# Altium project Luchador Rev 3.2.PrjPcb (part 2 of 4)

## Sheet Power Supply.SchDoc
size B; SheetNumber: 3; SheetTotal: 11; TitleBlk1Sch: PCBA, LUCHADOR, REV 3.2b, AMBER; Eng: Haman; EngDate: 3-15-19; RevSch: 01; TitleBlk2Sch: Power Supply
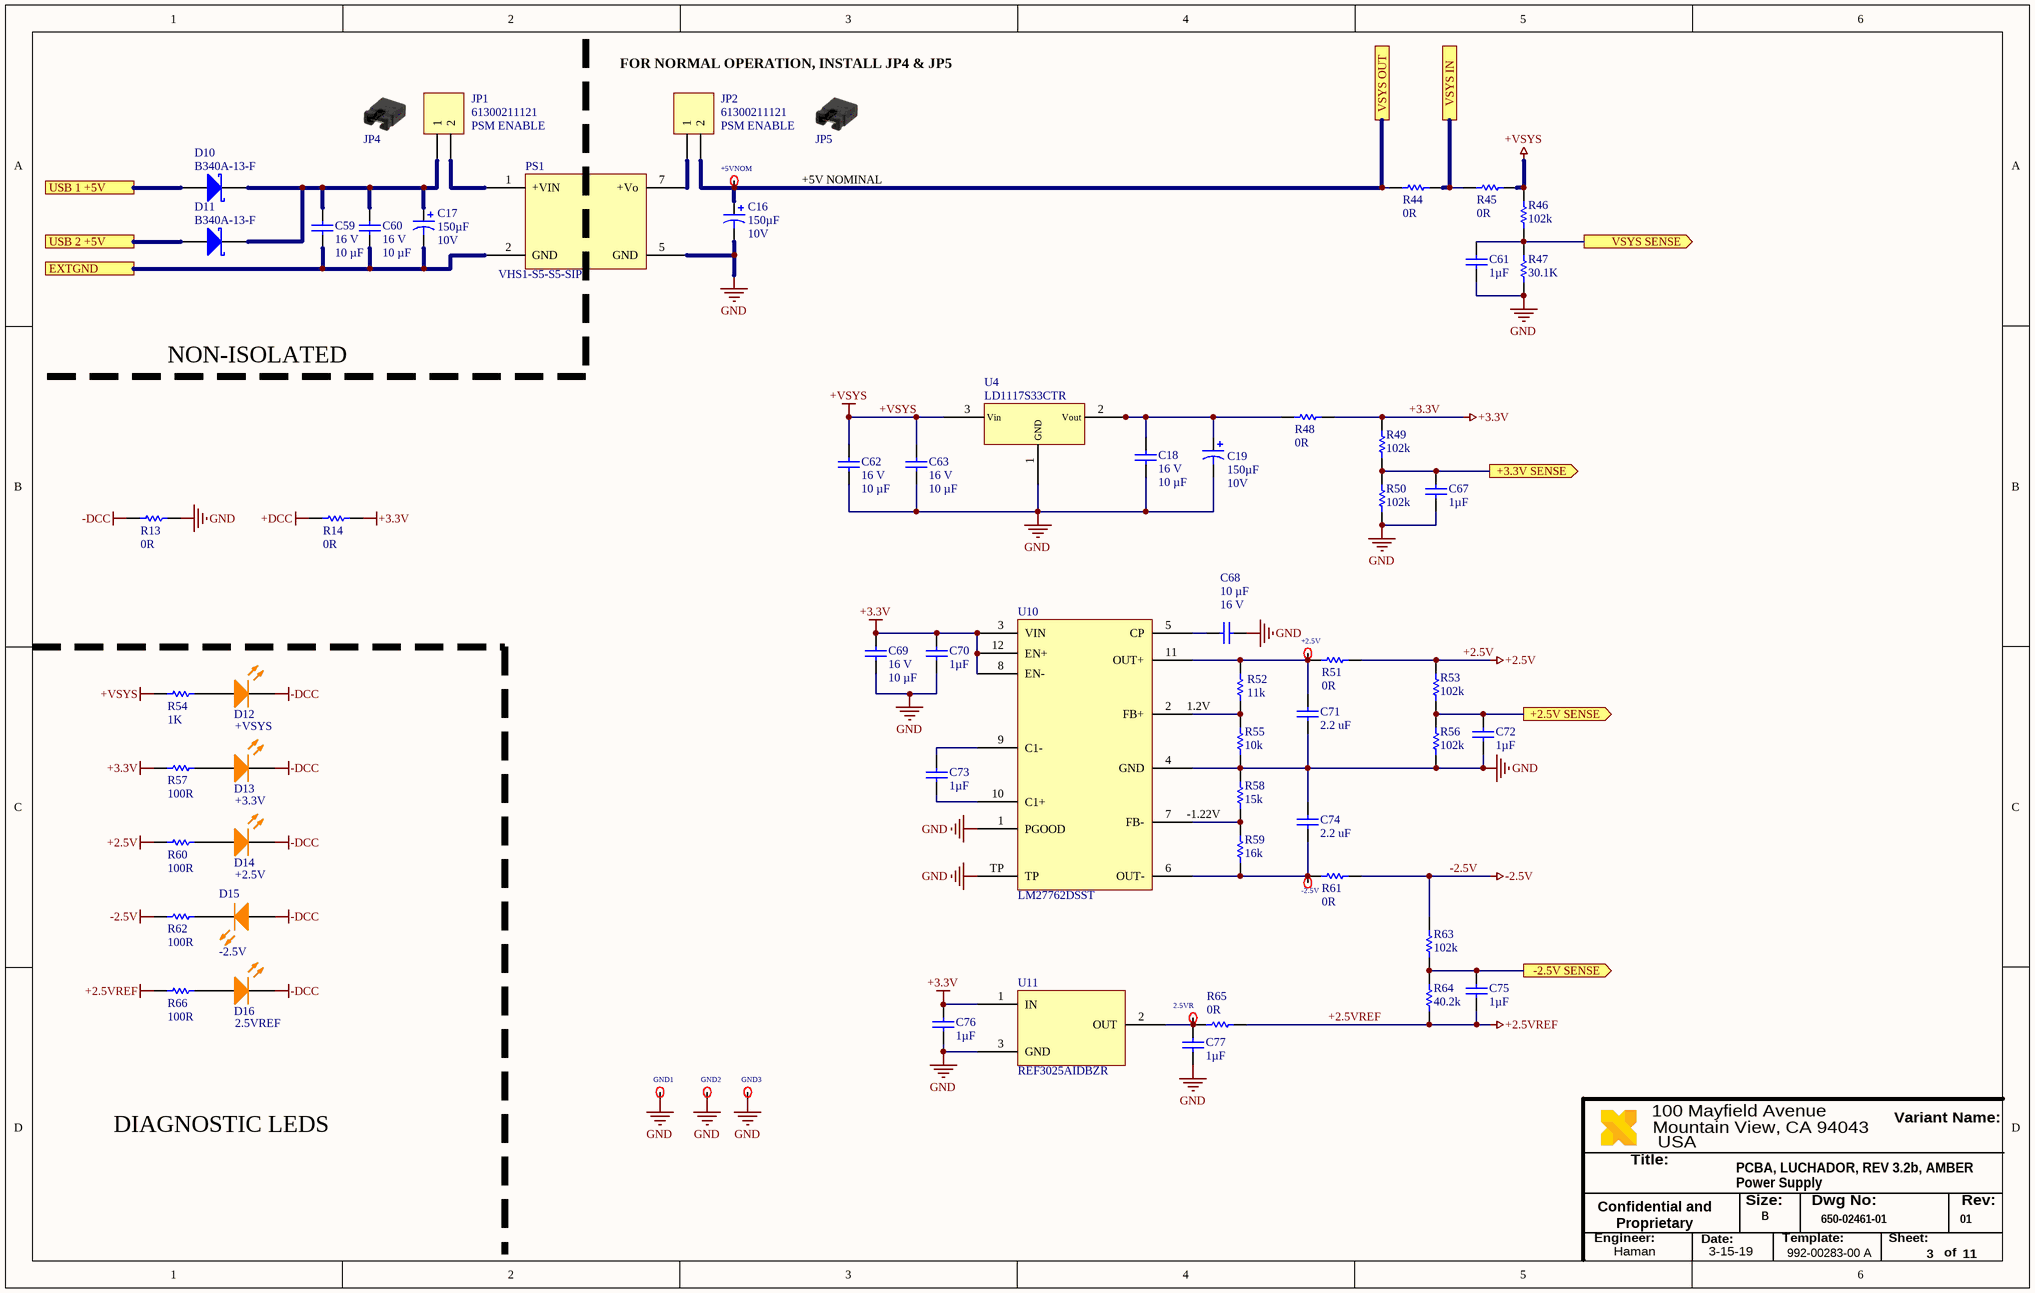
[diagram p2: Power Supply.SchDoc]

### Parts
2.5VR  5001  [KEYSTONE TP]  (value not drawn)  (no BOM)
+2.5V  5001  [KEYSTONE TP]  (value not drawn)  (no BOM)
+5VNOM  5001  [KEYSTONE TP]  (value not drawn)  (no BOM)
-2.5V  5001  [KEYSTONE TP]  (value not drawn)  (no BOM)
C16  Capacitance: 150µF  Voltage - Rated: 10V  [2917]  (hidden comment: Cap Pol1)
C17  Capacitance: 150µF  Voltage - Rated: 10V  [2917]  (hidden comment: Cap Pol1)
C18  Nominal voltage: 16 V  Capacity (elec.): 10 µF  [1206C]  (hidden comment: 50V)
C19  Capacitance: 150µF  Voltage - Rated: 10V  [2917]  (hidden comment: Cap Pol1)
C59  Nominal voltage: 16 V  Capacity (elec.): 10 µF  [1206C]  (hidden comment: 50V)
C60  Nominal voltage: 16 V  Capacity (elec.): 10 µF  [1206C]  (hidden comment: 50V)
C61  Capacitance: 1µF  [0402C]  (hidden comment: 50V)
C62  Nominal voltage: 16 V  Capacity (elec.): 10 µF  [1206C]  (hidden comment: 50V)
C63  Nominal voltage: 16 V  Capacity (elec.): 10 µF  [1206C]  (hidden comment: 50V)
C67  Capacitance: 1µF  [0402C]  (hidden comment: 50V)
C68  Nominal voltage: 16 V  Capacity (elec.): 10 µF  [1206C]  (hidden comment: 50V)
C69  Nominal voltage: 16 V  Capacity (elec.): 10 µF  [1206C]  (hidden comment: 50V)
C70  Capacitance: 1µF  [0402C]  (hidden comment: 50V)
C71  Capacitance Value: 2.2 uF  [0402C]  (hidden comment: 50V)
C72  Capacitance: 1µF  [0402C]  (hidden comment: 50V)
C73  Capacitance: 1µF  [0402C]  (hidden comment: 50V)
C74  Capacitance Value: 2.2 uF  [0402C]  (hidden comment: 50V)
C75  Capacitance: 1µF  [0402C]  (hidden comment: 50V)
C76  Capacitance: 1µF  [0402C]  (hidden comment: 50V)
C77  Capacitance: 1µF  [0402C]  (hidden comment: 50V)
D10  Manufacturer Part Number: B340A-13-F  [SMA]  (hidden comment: BAT46ZFILM)
D11  Manufacturer Part Number: B340A-13-F  [SMA]  (hidden comment: BAT46ZFILM)
D12  +VSYS  [0402L-ORANGE]
D13  +3.3V  [0402L-ORANGE]
D14  +2.5V  [0402L-ORANGE]
D15  -2.5V  [0402L-ORANGE]
D16  2.5VREF  [0402L-ORANGE]
GND1  5001  [KEYSTONE TP]  (value not drawn)  (no BOM)
GND2  5001  [KEYSTONE TP]  (value not drawn)  (no BOM)
GND3  5001  [KEYSTONE TP]  (value not drawn)  (no BOM)
JP1  PSM ENABLE  [61300211121]
JP2  PSM ENABLE  [61300211121]
JP4  QPC02SXGN-RC  (value not drawn)  (mechanical)
JP5  QPC02SXGN-RC  (value not drawn)  (mechanical)
PS1  VHS1-S5-S5-SIP  [ISOLATED MODULE]
R13  Resistance (Ohms): 0R  [0402R]  (hidden comment: Res 0805)
R14  Resistance (Ohms): 0R  [0402R]  (hidden comment: Res 0805)
R44  Resistance (Ohms): 0R  [0402R]  (hidden comment: Res 0805)
R45  Resistance (Ohms): 0R  [0402R]  (hidden comment: Res 0805)
R46  Resistance: 102k  [0402R]  (hidden comment: Res 0805)
R47  Resistance: 30.1K  [0402R]  (hidden comment: Res 0805)
R48  Resistance (Ohms): 0R  [0402R]  (hidden comment: Res 0805)
R49  Resistance: 102k  [0402R]  (hidden comment: Res 0805)
R50  Resistance: 102k  [0402R]  (hidden comment: Res 0805)
R51  Resistance (Ohms): 0R  [0402R]  (hidden comment: Res 0805)
R52  Resistance: 11k  [0402R]  (hidden comment: Res 0805)
R53  Resistance: 102k  [0402R]  (hidden comment: Res 0805)
R54  Resistance: 1K  [0402R]  (hidden comment: Res 0805)
R55  Resistance: 10k  [0402R]  (hidden comment: Res 0805)
R56  Resistance: 102k  [0402R]  (hidden comment: Res 0805)
R57  Resistance: 100R  [0402R]  (hidden comment: Res 0805)
R58  Resistance: 15k  [0402R]  (hidden comment: Res 0805)
R59  Resistance: 16k  [0402R]  (hidden comment: Res 0805)
R60  Resistance: 100R  [0402R]  (hidden comment: Res 0805)
R61  Resistance (Ohms): 0R  [0402R]  (hidden comment: Res 0805)
R62  Resistance: 100R  [0402R]  (hidden comment: Res 0805)
R63  Resistance: 102k  [0402R]  (hidden comment: Res 0805)
R64  Resistance: 40.2k  [0402R]  (hidden comment: Res 0805)
R65  Resistance (Ohms): 0R  [0402R]  (hidden comment: Res 0805)
R66  Resistance: 100R  [0402R]  (hidden comment: Res 0805)
U4  LD1117S33CTR  [SOT-223]
U10  LM27762DSST  [WFDFN-12]
U11  REF3025AIDBZR  [SOT-23]

### Ports
+2.5V SENSE (out), +3.3V SENSE (out), -2.5V SENSE (out), EXTGND, USB 1 +5V, USB 2 +5V, VSYS IN, VSYS OUT, VSYS SENSE (out)

### Nets
+2.5V: R51.2 R53.2 R60.1
+2.5VREF: C75.2 R64.1 R65.2 R66.1
+3.3V: C69.1 C70.1 C76.1 R14.2 R48.2 R49.2 R57.1 U10.3(VIN) U10.8(EN-) U10.12(EN+) U11.1(IN)
+DCC: R14.1
+VSYS: C62.1 C63.1 R45.2 R46.2 R54.1 U4.3(Vin)
-2.5V: R61.2 R62.1 R63.2
-DCC: D12.2(K) D13.2(K) D14.2(K) D15.1(A) D16.2(K) R13.1
GND: C16.2 C18.2 C19.2 C61.2 C62.2 C63.2 C67.2 C68.2 C69.2 C70.2 C71.2 C72.2 C74.1 C76.2 C77.2 GND1.1 GND2.1 GND3.1 PS1.5(GND) R13.2 R47.1 R50.1 R55.1 R56.1 R58.2 U4.1(GND) U10.1(PGOOD) U10.4(GND) U10.TP U11.3(GND)
Net2.5VR_1: 2.5VR.1 C77.1 R65.1 U11.2(OUT)
Net+2.5V_1: +2.5V.1 C71.1 R51.1 R52.2 U10.11(OUT+)
Net+5VNOM_1: +5VNOM.1 C16.1 JP2.2 R44.1 ; port VSYS OUT
Net-2.5V_1: -2.5V.1 C74.2 R59.1 R61.1 U10.6(OUT-)
NetC17_1: C17.1 C59.1 C60.1 D10.2(K) D11.2(K) JP1.1
NetC17_2: C17.2 C59.2 C60.2 PS1.2(GND) ; port EXTGND
NetC18_1: C18.1 C19.1 R48.1 U4.2(Vout) U4.4(Vout)
NetC61_1: C61.1 R46.1 R47.2 ; port VSYS SENSE
NetC67_1: C67.1 R49.1 R50.2 ; port +3.3V SENSE
NetC68_1: C68.1 U10.5(CP)
NetC72_1: C72.1 R53.1 R56.2 ; port +2.5V SENSE
NetC73_1: C73.1 U10.9(C1-)
NetC73_2: C73.2 U10.10(C1+)
NetC75_1: C75.1 R63.1 R64.2 ; port -2.5V SENSE
NetD10_1: D10.1(A) ; port USB 1 +5V
NetD11_1: D11.1(A) ; port USB 2 +5V
NetD12_1: D12.1(A) R54.2
NetD13_1: D13.1(A) R57.2
NetD14_1: D14.1(A) R60.2
NetD15_2: D15.2(K) R62.2
NetD16_1: D16.1(A) R66.2
NetJP1_2: JP1.2 PS1.1(+VIN)
NetJP2_1: JP2.1 PS1.7(+Vo)
NetR44_2: R44.2 R45.1 ; port VSYS IN
NetR52_1: R52.1 R55.2 U10.2(FB+)
NetR58_1: R58.1 R59.2 U10.7(FB-)

### Notes on the sheet
- (near JP5) FOR NORMAL OPERATION, INSTALL JP4 & JP5
- +5V NOMINAL
- NON-ISOLATED
- 1.2V
- -1.22V
- DIAGNOSTIC LEDS
- Title:
- USA
- 100 Mayfield Avenue
- Mountain View, CA 94043
- Variant Name:
- Confidential and Proprietary
- Engineer:
- Date:
- Size:
- B
- Template:
- 992-00283-00 A
- Dwg No:
- Sheet:
- Rev:
- of

### Library data of the parts
2.5VR +2.5V +5VNOM -2.5V GND1-GND3 = 5001: Manufacturer: Keystone Electronics; Description1: TEST POINT PC MINI .040"D BLACK; Supplier 1: Digi-Key; Manufacturer Part Number: 5001; RoHS: RoHS Compliant; Category: Test and Measurement; Stock 1: 159085; Pricing 1: 1=0.34, 10=0.315, 50=0.2296, 100=0.2206, 250=0.19812, 500=0.1891, 1000=0.15759, 2500=0.14408, 5000=0.13508 (USD); Packaging: Bulk; Type: PC Test Point, Miniature; Terminal: 0.010" x 0.020" (0.25mm x 0.51mm) Phosphor Bronze Wire, Silver Plated; Mounting Type: 0.040" (1.02mm) Hole Diameter; Material: Base, Nylon 46, UL 94V-0; Color: Black; ComponentLink1URL: http://www.keyelco.com/product-pdf.cfm?p=1310; ComponentLink1Description: http://www.keyelco.com/product-pdf.cfm?p=1310; Supplier Part Number 1: 5001K-ND
C16 C17 C19 = Cap Pol1: Polarized Capacitor (Radial); Manufacturer: KEMET; Manufacturer Part Number: T530D157M010ATE005; Manufacturer Size Code: D; Description1: Cap Tant Organic 150uF 10VDC D CASE 20% (7.3 X 4.3 X 2.8mm) SMD 7343-31 0.005 Ohm 125C T/R; Featured Product: KO-CAP Organic Polymer Capacitors  T530 Series Polymer Electrolytic Capacitors; PCN Design/Specification: TA Polymer SMD Black Epoxy Conversion 24/Oct/2014; EDA / CAD Models: Download from Accelerated Designs; Tolerance: ±20%; ESR (Equivalent Series Resistance): 5 mOhm; Type: Molded; Lifetime @ Temp.: 2000 Hrs @ 105°C; Online Catalog: KO Cap T530 Series; Other Names: 399-10369-2; Supplier 1: Digi-Key; Supplier Part Number 1: 399-10369-1-ND; Stock 1: 6616; Pricing 1: 1=5.98, 10=5.313, 100=4.2504 (USD); Standard Package: 500; Category: Capacitors; Family: Tantalum - Polymer Capacitors; Series: KO-CAP T530; Packaging: Tape & Reel (TR); Operating Temperature: -55°C ~ 125°C; Mounting Type: Surface Mount; Package / Case: 2917 (7343 Metric); Size / Dimension: 0.287" L x 0.169" W (7.30mm x 4.30mm); Height - Seated (Max): 0.122" (3.10mm); Lead Spacing: -; Features: General Purpose
C18 C59 C60 C62 C63 C68 C69 = Cap: CAP .1UF 50V CERAMIC Y5V 0805; Manufacturer: Murata; Manufacturer Part Number: GRM31CR71C106KA12L; Description1: MURATA   GRM31CR71C106KA12L   SMD Multilayer Ceramic Capacitor, 10 F,  10%, X7R, 16 V, 1206 [3216 Metric]; Tolerance: 10 %; Material properties: X7R; Content: 1 pc(s); Type: SMD; Revision: July-2002: Re-released for DXP Platform.; Supplier 1: Digi-Key; Supplier Part Number 1: 490-10526-2-ND; Stock 1: 0; Pricing 1: 2000=0.08 (USD); Category: Ceramic capacitor; Material: Ceramic; ComponentLink1URL: https://datasheet.ciiva.com/22774/608985-22774038.pdf; ComponentLink1Description: https://datasheet.ciiva.com/22774/608985-22774038.pdf; ComponentLink2URL: https://datasheet.ciiva.com/17454/c02e-17454536.pdf; ComponentLink2Description: https://datasheet.ciiva.com/17454/c02e-17454536.pdf; ComponentLink3URL: https://datasheet.ciiva.com/11607/c02e-11607499.pdf; ComponentLink3Description: https://datasheet.ciiva.com/11607/c02e-11607499.pdf; ComponentLink4URL: https://datasheet.ciiva.com/18697/c02e-18697819.pdf; ComponentLink4Description: https://datasheet.ciiva.com/18697/c02e-18697819.pdf; ComponentLink5URL: https://datasheet.ciiva.com/7937/608985-7937740.pdf; ComponentLink5Description: https://datasheet.ciiva.com/7937/608985-7937740.pdf; ComponentLink6URL: https://datasheet.ciiva.com/18697/c02e-18697820.pdf; ComponentLink6Description: https://datasheet.ciiva.com/18697/c02e-18697820.pdf; ComponentLink7URL: https://datasheet.ciiva.com/18697/c02e-18697821.pdf; ComponentLink7Description: https://datasheet.ciiva.com/18697/c02e-18697821.pdf; ComponentLink8URL: https://datasheet.ciiva.com/29202/451342-da-01-de-vs-kondens-grm31-cr71c-106ka12l-29202404.pdf; ComponentLink8Description: https://datasheet.ciiva.com/29202/451342-da-01-de-vs-kondens-grm31-cr71c-106ka12l-29202404.pdf; ComponentLink9URL: https://datasheet.ciiva.com/29202/450988-da-01-de-vs-chip-kond-1206-10-0-uf-10pr-16-0v-x7r-29202582.pdf; ComponentLink9Description: https://datasheet.ciiva.com/29202/450988-da-01-de-vs-chip-kond-1206-10-0-uf-10pr-16-0v-x7r-29202582.pdf
C61 C67 C70 C72 C73 C75-C77 = Cap: CAP .1UF 50V CERAMIC Y5V 0805; Manufacturer: TDK; Manufacturer Part Number: CGB2A1JB1C105K033BC; PCN Part Number: MLCC Part Number Change 30/Nov/2012; Description1: 1µF ±10% 16V JB Ceramic Capacitor -25°C ~ 85°C Surface Mount, MLCC 0402 (1005 Metric) 0.039" L x 0.020" W (1.00mm x 0.50mm); Product Training Modules: SEAT, CCV, and TVCL Design Tools Guide to Replacing an Electrolytic Capacitor with an MLCC; Featured Product: CGB Series Capacitors CH and JB Temperature Coefficient Capacitors; EDA / CAD Models: Download from Accelerated Designs; Tolerance: ±10%; Voltage - Rated: 16V; Temperature Coefficient: JB; Online Catalog: CGB Series; Other Names: 445-12011-6; Revision: July-2002: Re-released for DXP Platform.; Supplier 1: Digi-Key; Supplier Part Number 1: 445-12011-1-ND; Stock 1: 7430; Pricing 1: 1=0.22, 10=0.151, 100=0.0765, 500=0.0523, 1000=0.0463, 2500=0.0443, 5000=0.0403 (USD); RoHS Information: RoHS Certificate-MLCC; Standard Package: 1; Category: Capacitors; Family: Ceramic Capacitors; Series: CGB; Packaging: Digi-Reel®; Mounting Type: Surface Mount, MLCC; Operating Temperature: -25°C ~ 85°C; Applications: General Purpose; Package / Case: 0402 (1005 Metric); Size / Dimension: 0.039" L x 0.020" W (1.00mm x 0.50mm); Thickness (Max): 0.013" (0.33mm); Features: Low Profile; ComponentLink1URL: https://product.tdk.com/info/en/catalog/datasheets/mlcc_commercial_lowprofile_en.pdf; ComponentLink1Description: https://product.tdk.com/info/en/catalog/datasheets/mlcc_commercial_lowprofile_en.pdf; ComponentLink2URL: https://product.tdk.com/info/en/catalog/spec/mlccspec_commercial_lowprofile_en.pdf; ComponentLink2Description: https://product.tdk.com/info/en/catalog/spec/mlccspec_commercial_lowprofile_en.pdf; ComponentLink3URL: http://product.tdk.com/en/catalog/datasheets/mlcc_commercial_lowprofile_en.pdf; ComponentLink3Description: http://product.tdk.com/en/catalog/datasheets/mlcc_commercial_lowprofile_en.pdf
C71 C74 = Cap: CAP .1UF 50V CERAMIC Y5V 0805; Manufacturer: Samsung; Manufacturer Part Number: CL05A225KO5NQNC; Description1: Cap Ceramic 2.2uF 16V X5R 10% SMD 0402 85C Cardboard T/R; Rad Hard: No; Product Depth: 0.5 mm; Voltage: 16 Vdc; Tolerance: 10 %; Dielectric: X5R; Product Length: 1 mm; Revision: July-2002: Re-released for DXP Platform.; Supplier 1: Digi-Key; Supplier Part Number 1: 1276-1461-1-ND; Stock 1: 100000; Pricing 1: 1=0.58, 10=0.41, 100=0.27, 500=0.2, 1000=0.17, 2500=0.16, 5000=0.15 (USD); Packaging: Tape & Reel; Package/Case: 0402; Mounting: Surface Mount; Operating Temperature: -55 to 85 °C; Construction: Flat; Product Height: 0.5 mm; Category: Capacitor Ceramic Multilayer; ComponentLink1URL: https://datasheet.ciiva.com/26838/getdatasheetpartid-357511-26838176.pdf; ComponentLink1Description: https://datasheet.ciiva.com/26838/getdatasheetpartid-357511-26838176.pdf; ComponentLink2URL: https://datasheet.ciiva.com/25724/cl05a225ko5nqnc-25724388.pdf; ComponentLink2Description: https://datasheet.ciiva.com/25724/cl05a225ko5nqnc-25724388.pdf
D10 D11 = BAT46ZFILM: Schottky Rectifier; Manufacturer: Diodes Incorporated; Description1: DIODE SCHOTTKY 40V 3A SMA; Voltage - DC Reverse (Vr) (Max): 40V; Current - Average Rectified (Io): 3A; Voltage - Forward (Vf) (Max) @ If: 500mV @ 3A; Speed: Fast Recovery =< 500ns, > 200mA (Io); Current - Reverse Leakage @ Vr: 500µA @ 40V; Capacitance @ Vr, F: 200pF @ 4V, 1MHz; Supplier 1: Digi-Key; Supplier Part Number 1: B340A-FDICT-ND; RoHS: RoHS Compliant; Category: Discrete Semiconductor Products; Stock 1: 304487; Pricing 1: 1=0.42, 10=0.339, 100=0.231, 500=0.1729, 1000=0.1295 (USD); Packaging: Cut Tape (CT); Part Status: Active; Diode Type: Schottky; Reverse Recovery Time (trr): -; Mounting Type: Surface Mount; Package / Case: DO-214AC, SMA; Supplier Device Package: SMA; Operating Temperature - Junction: -55°C ~ 150°C; ComponentLink1URL: http://www.diodes.com/_files/datasheets/ds30891.pdf; ComponentLink1Description: http://www.diodes.com/_files/datasheets/ds30891.pdf
D12-D16 = LED0_1: Typical INFRARED GaAs LED; Manufacturer: Vishay; Manufacturer Part Number: VLMO1500-GS08; Description1: Standard LEDs - SMD 0402 SOFT ORANGE Non-Diff; Illumination Color: Orange; Wavelength/Color Temperature: 605 nm; Luminous Intensity: 90 mcd; Viewing Angle: 130 deg; Lens Color/Style: Water Clear; If - Forward Current: 30 mA; Vf - Forward Voltage: 2 V; Power Rating: 75 mW; Brand: Vishay Semiconductors; Supplier 1: Digi-Key; Supplier Part Number 1: VLMO1500-GS08CT-ND; Stock 1: 194938; Pricing 1: 1=0.53, 10=0.38, 25=0.2916, 100=0.1901, 250=0.1394, 500=0.1183, 1000=0.0972 (USD); Product Category: Standard LEDs - SMD; RoHS: True; Package / Case: 0402 (1005 metric); Length: 1 mm; Height: 0.35 mm; Width: 0.5 mm; Minimum Operating Temperature: - 30 C; Maximum Operating Temperature: + 85 C; Series: VLMx; Packaging: Reel; Mounting Style: SMD/SMT; Factory Pack Quantity: 9000; Tradename: ChipLED; ComponentLink1URL: https://datasheet.ciiva.com/13945/vlmo1500-13945355.pdf; ComponentLink1Description: https://datasheet.ciiva.com/13945/vlmo1500-13945355.pdf; ComponentLink2URL: https://datasheet.ciiva.com/13945/vlmo1500-13945356.pdf; ComponentLink2Description: https://datasheet.ciiva.com/13945/vlmo1500-13945356.pdf; ComponentLink3URL: https://datasheet.ciiva.com/13945/vlmo1500-13945357.pdf; ComponentLink3Description: https://datasheet.ciiva.com/13945/vlmo1500-13945357.pdf
JP1 JP2 = Header 2: Header, 2-Pin; Manufacturer: Wurth Electronics; Description1: Headers & Wire Housings WR-PHD 2.54mm Header 2P THT; Number of Positions / Contacts: 2; Pitch: 2.54 mm; Mounting Angle: Straight; Current Rating: 3 A; Latching Type: Unlatched; Voltage Rating: 250 V; Supplier 1: Digi-Key; Supplier Part Number 1: 732-5315-ND; Manufacturer Part Number: 61300211121; Stock 1: 53953; Pricing 1: 1=0.13, 10=0.106, 25=0.088, 50=0.074, 100=0.067, 1000=0.061 (USD); Mounting Style: Through Hole; Product Category: Headers & Wire Housings; RoHS: Details; Series: WR-PHD; Product Type: Headers; Type: Pin Strip; Number of Positions: 2; Number of Rows: 1; Contact Gender: Pin (Male); Contact Plating: Gold; Housing Material: Polybutylene Terephthalate (PBT); Termination Style: Through Hole; Brand: Wurth Electronics; Contact Material: Copper Alloy; Operating Temperature Range: - 40 C to + 125 C; Packaging: Bulk
JP4 JP5 = QPC02SXGN-RC: Manufacturer: Sullins; Description1: CONN JUMPER SHORTING .100" GOLD; Gender: Female Sockets; Number of Positions or Pins (Grid): 2 (1 x 2); Pitch: 0.100" (2.54mm); Dynamic Catalog: Shunts and Jumpers - Sullins Connector Solutions; Other Names: S9337; Supplier 1: Digi-Key; Supplier Part Number 1: S9337-ND; Stock 1: 955884; Pricing 1: 1=0.1, 10=0.059, 25=0.044, 50=0.0378, 100=0.0365, 250=0.0315, 500=0.0302, 1000=0.0265, 2500=0.0239 (USD); Standard Package: 2,000; Category: Connectors, Interconnects; Family: Shunts, Jumpers; Type: Open Top; Height: 0.235" (5.97mm); Contact Finish: Gold; Contact Finish Thickness: Flash; Packaging: Bulk; ComponentLink1URL: https://s3.amazonaws.com/catalogspreads-pdf/PAGE128-129%20.100%20JUMPER.pdf; ComponentLink1Description: https://s3.amazonaws.com/catalogspreads-pdf/PAGE128-129%20.100%20JUMPER.pdf; Manufacturer Part Number: QPC02SXGN-RC
PS1 = VHS1-S5-S5-SIP: Manufacturer: CUI; Power (Watts) - Manufacture Series: 1W; Description1: CONVERTER DC/DC 5V OUT 1W; Product Training Modules: Low Power DC-DC Converters EMI Regulations and Mitigation Considerations for Switching Power Supplies Reliability Considerations for Power Supplies Power Supply Safety Standards, Agencies and Marks Thermal Management of Power Supplies; Other Drawings: VHS1-SIP Series Bottom VHS1-SIP Series Side; Number of Outputs: 1; Voltage - Input (Min): 4.5V; Voltage - Input (Max): 5.5V; Voltage - Output 1: 5V; Current - Output (Max): 200mA; Voltage - Isolation: 6kV (6000V); Efficiency: 72%; Online Catalog: VHS1-SIP Series; Other Names: 102-1449  656-90111R  VHS1S5S5SIP; Supplier 1: Digi-Key; Supplier Part Number 1: 102-1449-ND; Stock 1: 18932; Pricing 1: 1=8.47, 5=8.35, 12=8.2283, 36=7.9861, 60=7.744, 108=7.502, 252=7.26, 504=6.776 (USD); RoHS Information: VHS1-SIP Series  Cert of Compliance; 3D Model: VHS1-S5-S5-SIP; Standard Package: 25; Category: Power Supplies - Board Mount; Family: DC DC Converters; Series: VHS1-SIP; Packaging: -; Type: Isolated Module; Voltage - Output 2: -; Voltage - Output 3: -; Applications: Medical; Features: SCP; Mounting Type: Through Hole; Package / Case: 7-SIP Module (4 Leads); Size / Dimension: 0.77" L x 0.39" W x 0.49" H (19.5mm x 9.8mm x 12.5mm); Operating Temperature: -40°C ~ 85°C; Power (Watts) - Max: 1W; Manufacturer Part Number: VHS1-S5-S5-SIP
R13 R14 R44 R45 R48 R51 R61 R65 = Res 0805: Resistor; Manufacturer: Panasonic; Manufacturer Part Number: ERJ-2GE0R00X; Description1: Res Thick Film 0402 0 Ohm Molded SMD Automotive T/R; EDA / CAD Models: Download from Accelerated Designs; Tolerance: Jumper; Power (Watts): 0.1W, 1/10W; Online Catalog: ERJ Series; Other Names: P0.0JDKR; Supplier 1: Digi-Key; Supplier Part Number 1: P0.0JCT-ND; Stock 1: 31263960; Pricing 1: 1=0.1, 10=0.037, 25=0.0268, 50=0.0204, 100=0.015, 250=0.0114, 500=0.0091, 1000=0.0067, 5000=0.0048 (USD); Standard Package: 1; Category: Resistors; Family: Chip Resistor - Surface Mount; Series: ERJ; Packaging: Digi-Reel®; Composition: Thick Film; Features: Automotive AEC-Q200; Temperature Coefficient: -; Operating Temperature: -55°C ~ 155°C; Package / Case: 0402 (1005 Metric); Supplier Device Package: 0402; Size / Dimension: 0.039" L x 0.020" W (1.00mm x 0.50mm); Height: 0.016" (0.40mm); Number of Terminations: 2; ComponentLink1URL: https://datasheet.ciiva.com/48531/aoa0000ce1-48531077.pdf; ComponentLink1Description: https://datasheet.ciiva.com/48531/aoa0000ce1-48531077.pdf; ComponentLink2URL: https://datasheet.ciiva.com/16783/70260739-16783734.pdf; ComponentLink2Description: https://datasheet.ciiva.com/16783/70260739-16783734.pdf; ComponentLink3URL: https://datasheet.ciiva.com/11821/0900766b80f806dd-11821176.pdf; ComponentLink3Description: https://datasheet.ciiva.com/11821/0900766b80f806dd-11821176.pdf; ComponentLink4URL: https://datasheet.ciiva.com/17215/aoa0000ce1-17215386.pdf; ComponentLink4Description: https://datasheet.ciiva.com/17215/aoa0000ce1-17215386.pdf; ComponentLink5URL: https://datasheet.ciiva.com/43460/1678796-43460347.pdf; ComponentLink5Description: https://datasheet.ciiva.com/43460/1678796-43460347.pdf; ComponentLink6URL: https://datasheet.ciiva.com/5959/1678796-5959692.pdf; ComponentLink6Description: https://datasheet.ciiva.com/5959/1678796-5959692.pdf; ComponentLink7URL: https://datasheet.ciiva.com/30097/4aoa0000ce1-30097116.pdf; ComponentLink7Description: https://datasheet.ciiva.com/30097/4aoa0000ce1-30097116.pdf; ComponentLink8URL: https://datasheet.ciiva.com/28695/1678796-28695758.pdf; ComponentLink8Description: https://datasheet.ciiva.com/28695/1678796-28695758.pdf; ComponentLink9URL: https://datasheet.ciiva.com/46389/1678796-46389518.pdf; ComponentLink9Description: https://datasheet.ciiva.com/46389/1678796-46389518.pdf; ComponentLink10URL: https://datasheet.ciiva.com/16778/70260739-16778335.pdf; ComponentLink10Description: https://datasheet.ciiva.com/16778/70260739-16778335.pdf
R46 R49 R50 R53 R56 R63 = Res 0805: Resistor; Manufacturer: Panasonic; Manufacturer Part Number: ERJ-2RKF1023X; Description1: Res Thick Film 0402 102K Ohm 1% 0.1W(1/10W) ±100ppm/C Molded SMD Automotive T/R; Temperature Coefficient: ± 100ppm/°C; Voltage Rating: 50V; SVHC: To Be Advised; Product Range: PANASONIC - ERJ Series; Power Rating: 100mW; Resistance Tolerance: ± 1%; Resistor Case Style: 0402 ^1005 Metric]; Resistor Element Type: Thick Film; Supplier 1: Digi-Key; Supplier Part Number 1: P102KLCT-ND; Stock 1: 276077; Pricing 1: 1=0.1, 10=0.056, 100=0.0227, 1000=0.0102, 2500=0.0089, 5000=0.0073 (USD); Packaging: Full Reel; ComponentLink1URL: https://datasheet.ciiva.com/16763/70260748-16763080.pdf; ComponentLink1Description: https://datasheet.ciiva.com/16763/70260748-16763080.pdf; ComponentLink2URL: https://datasheet.ciiva.com/43467/1678782-43467481.pdf; ComponentLink2Description: https://datasheet.ciiva.com/43467/1678782-43467481.pdf; ComponentLink3URL: https://datasheet.ciiva.com/9119/aoa0000ce2-9119242.pdf; ComponentLink3Description: https://datasheet.ciiva.com/9119/aoa0000ce2-9119242.pdf; ComponentLink4URL: https://datasheet.ciiva.com/7712/1678782-7712798.pdf; ComponentLink4Description: https://datasheet.ciiva.com/7712/1678782-7712798.pdf; ComponentLink5URL: https://datasheet.ciiva.com/16781/70260748-16781503.pdf; ComponentLink5Description: https://datasheet.ciiva.com/16781/70260748-16781503.pdf; ComponentLink6URL: https://datasheet.ciiva.com/22673/1678782-22673487.pdf; ComponentLink6Description: https://datasheet.ciiva.com/22673/1678782-22673487.pdf; ComponentLink7URL: https://datasheet.ciiva.com/46373/1678782-46373215.pdf; ComponentLink7Description: https://datasheet.ciiva.com/46373/1678782-46373215.pdf
R47 = Res 0805: Resistor; Manufacturer: Panasonic; Manufacturer Part Number: ERJ-2RKF3012X; Description1: PANASONIC ELECTRONIC COMPONENTS         ERJ2RKF3012X             SMD Chip Resistor, Thick Film, 30.1 kohm, 50 V, 0402 [1005 Metric], 100 mW,  1%, ERJ2R Series; Rated Power: 0.1 W; Tolerance (%): ±1 %; Temp Coefficient: ±100 ppm/°C; Working Voltage-Nom: 50 V; Overload Voltage - Max: 100 V; No. of Terminations: 2; Supplier 1: Digi-Key; Supplier Part Number 1: P30.1KLCT-ND; Stock 1: 680939; Pricing 1: 1=0.1, 10=0.056, 100=0.0227, 1000=0.0102, 2500=0.0089, 5000=0.0073 (USD); Technology: Thick Film; Operating Temp Range: -55 to +155 °C; Case Size: 0402 (1005 Metric); Dimension: 1 x 0.5 mm; Height - Max: 0.4 mm; ComponentLink1URL: https://datasheet.ciiva.com/16780/70260748-16780293.pdf; ComponentLink1Description: https://datasheet.ciiva.com/16780/70260748-16780293.pdf; ComponentLink2URL: https://datasheet.ciiva.com/28563/1678782-28563413.pdf; ComponentLink2Description: https://datasheet.ciiva.com/28563/1678782-28563413.pdf; ComponentLink3URL: https://datasheet.ciiva.com/30108/aoa0000ce2-30108661.pdf; ComponentLink3Description: https://datasheet.ciiva.com/30108/aoa0000ce2-30108661.pdf; ComponentLink4URL: https://datasheet.ciiva.com/9190/aoa0000ce2-9190840.pdf; ComponentLink4Description: https://datasheet.ciiva.com/9190/aoa0000ce2-9190840.pdf; ComponentLink5URL: https://datasheet.ciiva.com/28695/1678782-28695771.pdf; ComponentLink5Description: https://datasheet.ciiva.com/28695/1678782-28695771.pdf; ComponentLink6URL: https://datasheet.ciiva.com/46389/426256-46389467.pdf; ComponentLink6Description: https://datasheet.ciiva.com/46389/426256-46389467.pdf; ComponentLink7URL: https://datasheet.ciiva.com/24025/aoa0000ce2-24025263.pdf; ComponentLink7Description: https://datasheet.ciiva.com/24025/aoa0000ce2-24025263.pdf
R52 = Res 0805: Resistor; Manufacturer: Yageo; Manufacturer Part Number: RC0402FR-0711KL; Description1: RES SMD 11K OHM 1% 1/16W 0402; Tolerance: 1 %; Power Rating: 62.5 mW (1/16 W); Voltage Rating: 50 V; Temperature Coefficient: 100 PPM / C; Supplier 1: Digi-Key; Supplier Part Number 1: 311-11.0KLRCT-ND; Stock 1: 2904725; Pricing 1: 1=0.1, 10=0.016, 100=0.0067, 1000=0.003, 2500=0.0026, 5000=0.0022 (USD); Termination Style: SMD/SMT; Product: Thick Film Resistors General Purpose; Case Code - in: 0402; Case Code - mm: 1005; Series: RC; Operating Temperature Range: - 55 C to + 155 C; Packaging: Reel; ComponentLink1URL: http://www.yageo.com/documents/recent/PYu-RC_Group_51_RoHS_L_9.pdf; ComponentLink1Description: http://www.yageo.com/documents/recent/PYu-RC_Group_51_RoHS_L_9.pdf; ComponentLink2URL: http://www.mouser.com/ds/2/447/PYu-RC0402_51_RoHS_L_6_r-8721.pdf; ComponentLink2Description: http://www.mouser.com/ds/2/447/PYu-RC0402_51_RoHS_L_6_r-8721.pdf; ComponentLink3URL: http://www.farnell.com/datasheets/1018594.pdf; ComponentLink3Description: http://www.farnell.com/datasheets/1018594.pdf
R54 = Res 0805: Resistor; Manufacturer: Yageo; Manufacturer Part Number: RC0402FR-071KL; Description1: RES SMD 1K OHM 1% 1/16W 0402; Tolerance: 1 %; Power Rating: 62.5 mW (1/16 W); Voltage Rating: 50 V; Temperature Coefficient: 100 PPM / C; Supplier 1: Digi-Key; Supplier Part Number 1: 311-1.00KLRDKR-ND; Stock 1: 114983350; Pricing 1: 1=0.1, 10=0.016, 100=0.0067, 1000=0.003, 2500=0.0026, 5000=0.0022 (USD); Termination Style: SMD/SMT; Product: Thick Film Resistors General Purpose; Case Code - in: 0402; Case Code - mm: 1005; Series: RC; Operating Temperature Range: - 55 C to + 155 C; Packaging: Reel; ComponentLink1URL: http://documents.rs-components.com/techlib://itc_doclist_GB.htm?stockno=6186122; ComponentLink1Description: http://documents.rs-components.com/techlib://itc_doclist_GB.htm?stockno=6186122; ComponentLink2URL: http://www.mouser.com/ds/2/447/PYu-RC0402_51_RoHS_L_6_r-8721.pdf; ComponentLink2Description: http://www.mouser.com/ds/2/447/PYu-RC0402_51_RoHS_L_6_r-8721.pdf; ComponentLink3URL: http://www.yageo.com/documents/recent/PYu-RC0402_51_RoHS_L_6_r.pdf; ComponentLink3Description: http://www.yageo.com/documents/recent/PYu-RC0402_51_RoHS_L_6_r.pdf; ComponentLink4URL: http://www.farnell.com/datasheets/1018594.pdf; ComponentLink4Description: http://www.farnell.com/datasheets/1018594.pdf; ComponentLink5URL: http://www.farnell.com/datasheets/2167052.pdf; ComponentLink5Description: http://www.farnell.com/datasheets/2167052.pdf
R55 = Res 0805: Resistor; Manufacturer: Samsung; Manufacturer Part Number: RC1005F103CS; Description1: Res Thick Film 0402 10K Ohm 1% 0.063W(1/16W) ±100ppm/C Molded SMD T/R; Rated Power: 0.063 W; Tolerance (%): ±1 %; Temp Coefficient: ±100 ppm/°C; Supplier 1: Digi-Key; Supplier Part Number 1: 1276-3431-1-ND; Stock 1: 15935883; Pricing 1: 1=0.1, 10=0.021, 100=0.0087, 1000=0.0039, 2500=0.0034, 5000=0.0028 (USD); Size Code: 0402; ComponentLink1URL: https://datasheet.ciiva.com/15196/getdatasheetpartid-504789-15196214.pdf; ComponentLink1Description: https://datasheet.ciiva.com/15196/getdatasheetpartid-504789-15196214.pdf; ComponentLink2URL: https://datasheet.ciiva.com/16481/rcseries-16481007.pdf; ComponentLink2Description: https://datasheet.ciiva.com/16481/rcseries-16481007.pdf
R57 R60 R62 R66 = Res 0805: Resistor; Manufacturer: Panasonic; Manufacturer Part Number: ERJ-2RKF1000X; Description1: Res Thick Film 0402 100 Ohm 1% 0.1W(1/10W) ±100ppm/C Molded SMD Automotive T/R; Rated Power: 0.1 W; Tolerance (%): ±1 %; Temp Coefficient: ±100 ppm/°C; Supplier 1: Digi-Key; Supplier Part Number 1: P100LCT-ND; Stock 1: 14075966; Pricing 1: 1=0.1, 10=0.056, 100=0.0227, 1000=0.0102, 2500=0.0089, 5000=0.0073 (USD); Size Code: 0402; ComponentLink1URL: https://datasheet.ciiva.com/27056/2007311-27056035.pdf; ComponentLink1Description: https://datasheet.ciiva.com/27056/2007311-27056035.pdf; ComponentLink2URL: https://datasheet.ciiva.com/11821/0900766b80f80784-11821173.pdf; ComponentLink2Description: https://datasheet.ciiva.com/11821/0900766b80f80784-11821173.pdf; ComponentLink3URL: https://datasheet.ciiva.com/46372/1678782-46372741.pdf; ComponentLink3Description: https://datasheet.ciiva.com/46372/1678782-46372741.pdf; ComponentLink4URL: https://datasheet.ciiva.com/16199/aoa0000ce2-16199575.pdf; ComponentLink4Description: https://datasheet.ciiva.com/16199/aoa0000ce2-16199575.pdf; ComponentLink5URL: https://datasheet.ciiva.com/43467/1678782-43467223.pdf; ComponentLink5Description: https://datasheet.ciiva.com/43467/1678782-43467223.pdf; ComponentLink6URL: https://datasheet.ciiva.com/30260/aoa0000ce2-30260809.pdf; ComponentLink6Description: https://datasheet.ciiva.com/30260/aoa0000ce2-30260809.pdf; ComponentLink7URL: https://datasheet.ciiva.com/9186/aoa0000ce2-9186683.pdf; ComponentLink7Description: https://datasheet.ciiva.com/9186/aoa0000ce2-9186683.pdf; ComponentLink8URL: https://datasheet.ciiva.com/16776/70260748-16776427.pdf; ComponentLink8Description: https://datasheet.ciiva.com/16776/70260748-16776427.pdf; ComponentLink9URL: https://datasheet.ciiva.com/48531/aoa0000ce2-48531067.pdf; ComponentLink9Description: https://datasheet.ciiva.com/48531/aoa0000ce2-48531067.pdf; ComponentLink10URL: https://datasheet.ciiva.com/17207/aoa0000ce2-17207980.pdf; ComponentLink10Description: https://datasheet.ciiva.com/17207/aoa0000ce2-17207980.pdf; ComponentLink11URL: https://datasheet.ciiva.com/7830/426256-7830973.pdf; ComponentLink11Description: https://datasheet.ciiva.com/7830/426256-7830973.pdf; ComponentLink12URL: https://datasheet.ciiva.com/16522/aoa0000ce2-16522621.pdf; ComponentLink12Description: https://datasheet.ciiva.com/16522/aoa0000ce2-16522621.pdf; ComponentLink13URL: https://datasheet.ciiva.com/28514/1678782-28514175.pdf; ComponentLink13Description: https://datasheet.ciiva.com/28514/1678782-28514175.pdf
R58 = Res 0805: Resistor; Manufacturer: Panasonic; Manufacturer Part Number: ERJ-2RKF1502X; Description1: Res Thick Film 0402 15K Ohm 1% 0.1W(1/10W) ±100ppm/C Molded SMD Automotive Punched T/R; Tolerance: 1 %; Power Rating: 100 mW; Temperature Coefficient: 100 PPM / C; Voltage Rating: 50 V; Qualification: AEC-Q200; Unit Weight: 0.000028 oz; Supplier 1: Digi-Key; Supplier Part Number 1: P15.0KLCT-ND; Stock 1: 1770491; Pricing 1: 1=0.1, 10=0.056, 100=0.0227, 1000=0.0102, 2500=0.0089, 5000=0.0073 (USD); Product Category: Thick Film Resistors - SMD; RoHS: True; Case Code - in: 0402; Case Code - mm: 1005; Operating Temperature Range: - 55 C to + 155 C; Series: ERJ; Type: Precision Thick Film Resistors SMD; Brand: Panasonic; Height: 0.35 mm; Length: 1 mm; Package / Case: 0402 (1005 metric); Packaging: Reel; Product: Thick Film Resistors SMD; Factory Pack Quantity: 10000; Termination Style: SMD/SMT; Width: 0.5 mm; ComponentLink1URL: https://datasheet.ciiva.com/6138/aoa0000ce2-6138166.pdf; ComponentLink1Description: https://datasheet.ciiva.com/6138/aoa0000ce2-6138166.pdf; ComponentLink2URL: https://datasheet.ciiva.com/16765/70260748-16765542.pdf; ComponentLink2Description: https://datasheet.ciiva.com/16765/70260748-16765542.pdf; ComponentLink3URL: https://datasheet.ciiva.com/43467/1678782-43467414.pdf; ComponentLink3Description: https://datasheet.ciiva.com/43467/1678782-43467414.pdf; ComponentLink4URL: https://datasheet.ciiva.com/9193/aoa0000ce2-9193047.pdf; ComponentLink4Description: https://datasheet.ciiva.com/9193/aoa0000ce2-9193047.pdf; ComponentLink5URL: https://datasheet.ciiva.com/8079/426256-8079609.pdf; ComponentLink5Description: https://datasheet.ciiva.com/8079/426256-8079609.pdf; ComponentLink6URL: https://datasheet.ciiva.com/16778/70260748-16778682.pdf; ComponentLink6Description: https://datasheet.ciiva.com/16778/70260748-16778682.pdf; ComponentLink7URL: https://datasheet.ciiva.com/16371/aoa0000ce2-16371499.pdf; ComponentLink7Description: https://datasheet.ciiva.com/16371/aoa0000ce2-16371499.pdf; ComponentLink8URL: https://datasheet.ciiva.com/22687/1678782-22687068.pdf; ComponentLink8Description: https://datasheet.ciiva.com/22687/1678782-22687068.pdf; ComponentLink9URL: https://datasheet.ciiva.com/11821/0900766b80f80784-11821181.pdf; ComponentLink9Description: https://datasheet.ciiva.com/11821/0900766b80f80784-11821181.pdf; ComponentLink10URL: https://datasheet.ciiva.com/46372/1678782-46372862.pdf; ComponentLink10Description: https://datasheet.ciiva.com/46372/1678782-46372862.pdf; ComponentLink11URL: https://datasheet.ciiva.com/17211/aoa0000ce2-17211535.pdf; ComponentLink11Description: https://datasheet.ciiva.com/17211/aoa0000ce2-17211535.pdf; ComponentLink12URL: https://datasheet.ciiva.com/46372/1678782-46372863.pdf; ComponentLink12Description: https://datasheet.ciiva.com/46372/1678782-46372863.pdf
R59 = Res 0805: Resistor; Manufacturer: Panasonic; Manufacturer Part Number: ERJ-2RKF1602X; Description1: Panasonic ERJ2RK Series Thick Film Surface Mount Fixed Resistor 0402 Case 1% 0.1W 100ppm/C; Resistor Case Style: 0402; Resistor Mounting: SMD; Resistance Tolerance: ± 1%; Power Rating: 100mW; Voltage Rating: 50V; Temperature Coefficient: ± 100ppm/°C; Resistor Element Material: Thick Film; Supplier 1: Digi-Key; Supplier Part Number 1: P16.0KLCT-ND; Stock 1: 351031; Pricing 1: 1=0.1, 10=0.056, 100=0.0227, 1000=0.0102, 2500=0.0089, 5000=0.0073 (USD); ComponentLink1URL: https://datasheet.ciiva.com/9119/aoa0000ce2-9119254.pdf; ComponentLink1Description: https://datasheet.ciiva.com/9119/aoa0000ce2-9119254.pdf; ComponentLink2URL: https://datasheet.ciiva.com/43467/1678782-43467416.pdf; ComponentLink2Description: https://datasheet.ciiva.com/43467/1678782-43467416.pdf; ComponentLink3URL: https://datasheet.ciiva.com/24070/aoa0000ce2-24070362.pdf; ComponentLink3Description: https://datasheet.ciiva.com/24070/aoa0000ce2-24070362.pdf; ComponentLink4URL: https://datasheet.ciiva.com/16761/70260748-16761564.pdf; ComponentLink4Description: https://datasheet.ciiva.com/16761/70260748-16761564.pdf; ComponentLink5URL: https://datasheet.ciiva.com/11821/0900766b80f80784-11821213.pdf; ComponentLink5Description: https://datasheet.ciiva.com/11821/0900766b80f80784-11821213.pdf; ComponentLink6URL: https://datasheet.ciiva.com/22681/1678782-22681663.pdf; ComponentLink6Description: https://datasheet.ciiva.com/22681/1678782-22681663.pdf
R64 = Res 0805: Resistor; Manufacturer: Panasonic; Manufacturer Part Number: ERJ-2RKF4022X; Description1: Res Thick Film 0402 40.2K Ohm 1% 0.1W(1/10W) ±100ppm/C Molded SMD Automotive T/R; Resistor Element Type: Thick Film; Product Range: PANASONIC - ERJ Series; Power Rating: 100mW; Resistance Tolerance: ± 1%; Resistor Case Style: 0402 [1005 Metric]; Temperature Coefficient: ± 100ppm/°C; Voltage Rating: 50V; SVHC: Diboron trioxide (19-Dec-2012); Resistor Mounting: SMD; SVHC (Secondary): Lead monoxide (lead oxide) (19-Dec-2012); Supplier 1: Digi-Key; Supplier Part Number 1: P40.2KLCT-ND; Stock 1: 987602; Pricing 1: 1=0.1, 10=0.056, 100=0.0227, 1000=0.0102, 2500=0.0089, 5000=0.0073 (USD); Resistor Element Material: Thick Film; Packaging: Cut Tape; MSL: (Not Applicable); ComponentLink1URL: https://datasheet.ciiva.com/6159/426256-6159589.pdf; ComponentLink1Description: https://datasheet.ciiva.com/6159/426256-6159589.pdf; ComponentLink2URL: https://datasheet.ciiva.com/16786/70260748-16786006.pdf; ComponentLink2Description: https://datasheet.ciiva.com/16786/70260748-16786006.pdf; ComponentLink3URL: https://datasheet.ciiva.com/27055/1987281-27055654.pdf; ComponentLink3Description: https://datasheet.ciiva.com/27055/1987281-27055654.pdf; ComponentLink4URL: https://datasheet.ciiva.com/28693/1678782-28693542.pdf; ComponentLink4Description: https://datasheet.ciiva.com/28693/1678782-28693542.pdf; ComponentLink5URL: https://datasheet.ciiva.com/16771/70260748-16771239.pdf; ComponentLink5Description: https://datasheet.ciiva.com/16771/70260748-16771239.pdf; ComponentLink6URL: https://datasheet.ciiva.com/9189/aoa0000ce2-9189864.pdf; ComponentLink6Description: https://datasheet.ciiva.com/9189/aoa0000ce2-9189864.pdf; ComponentLink7URL: https://datasheet.ciiva.com/43460/426256-43460328.pdf; ComponentLink7Description: https://datasheet.ciiva.com/43460/426256-43460328.pdf; ComponentLink8URL: https://datasheet.ciiva.com/46377/426256-46377274.pdf; ComponentLink8Description: https://datasheet.ciiva.com/46377/426256-46377274.pdf; ComponentLink9URL: https://datasheet.ciiva.com/24160/aoa0000ce2-24160028.pdf; ComponentLink9Description: https://datasheet.ciiva.com/24160/aoa0000ce2-24160028.pdf
U4 = LD1117S33CTR: Manufacturer: STMicroelectronics; Description1: IC REG LDO 3.3V 0.8A SOT223; Regulator Topology: Positive Fixed; Voltage - Output: 3.3V; Current - Output: 800mA; Voltage - Dropout (Typical): 1.1V @ 800mA; Number of Regulators: 1; Voltage - Input: Up to 15V; Supplier 1: Digi-Key; Supplier Part Number 1: 497-1241-1-ND; RoHS: RoHS Compliant; Category: Integrated Circuits (ICs); Stock 1: 74769; Pricing 1: 1=0.46, 10=0.373, 100=0.2541, 500=0.1902, 1000=0.14245 (USD); Packaging: Cut Tape (CT); Part Status: Active; Current - Limit (Min): -; Operating Temperature: -40°C ~ 125°C; Mounting Type: Surface Mount; Package / Case: TO-261-4, TO-261AA; Supplier Device Package: SOT-223; ComponentLink1URL: http://www.st.com/web/en/resource/technical/document/datasheet/CD00000544.pdf; ComponentLink1Description: http://www.st.com/web/en/resource/technical/document/datasheet/CD00000544.pdf; Manufacturer Part Number: LD1117S33CTR
U10 = LM27762DSST: Manufacturer: Texas Instruments; Description1: Charge Pump Switching Regulator IC Positive and Negative (Dual Rail) Adjustable -5V, 1.5V 2 - Dual Output 250mA 12-WFDFN Exposed Pad; Function: Step-Up/Step-Down; Output Configuration: Positive and Negative (Dual Rail); Topology: Charge Pump; Output Type: Adjustable; Number of Outputs: 2 - Dual; Voltage - Input (Min): 2.7V; Voltage - Input (Max): 5.5V; Voltage - Output (Min/Fixed): -5V, 1.5V; Voltage - Output (Max): -1.5V, 5V; Current - Output: 250mA; Frequency - Switching: 1.7MHz ~ 2.3MHz; Synchronous Rectifier: No; Supplier 1: Digi-Key; Supplier Part Number 1: 296-44944-1-ND; Stock 1: 4423; Pricing 1: 1=2.43, 10=2.184, 100=1.7551 (USD); Category: Integrated Circuits (ICs); Family: PMIC - Voltage Regulators - DC DC Switching Regulators; Series: -; Packaging: Tape & Reel (TR); Part Status: Active; Operating Temperature: -40°C ~ 85°C (TA); Mounting Type: Surface Mount; Package / Case: 12-WFDFN Exposed Pad; Supplier Device Package: 12-WSON (3x2); ComponentLink1URL: http://www.ti.com/lit/ds/symlink/lm27762.pdf; ComponentLink1Description: http://www.ti.com/lit/ds/symlink/lm27762.pdf; Manufacturer Part Number: LM27762DSST
U11 = REF3025AIDBZR: Manufacturer: Texas Instruments; Manufacturer Product Page: REF3025AIDBZR Specifications; Description1: IC VREF SERIES 2.5V SOT23-3; Product Training Modules: Selecting Voltage References; Reference Type: Series; Output Type: Fixed; Voltage - Output (Min/Fixed): 2.5V; Current - Output: 25mA; Tolerance: ±0.2%; Temperature Coefficient: 75ppm/°C; Noise - 0.1Hz to 10Hz: 28µVp-p; Noise - 10Hz to 10kHz: 80µVrms; Voltage - Input: 2.55 V ~ 5.5 V; Current - Supply: 50µA; Online Catalog: Series, Fixed - Texas Instruments; Other Names: 296-26322-1; Supplier 1: Digi-Key; Supplier Part Number 1: 296-26322-1-ND; Stock 1: 53687; Pricing 1: 1=1.43, 10=1.282, 100=0.9997, 500=0.8259, 1000=0.652 (USD); Standard Package: 1; Category: Integrated Circuits (ICs); Family: PMIC - Voltage Reference; Series: -; Packaging: Cut Tape (CT); Voltage - Output (Max): -; Current - Cathode: -; Operating Temperature: -40°C ~ 125°C (TA); Mounting Type: Surface Mount; Package / Case: TO-236-3, SC-59, SOT-23-3; Supplier Device Package: SOT-23-3; ComponentLink1URL: https://datasheet.ciiva.com/2012/ref3012-2012418.pdf; ComponentLink1Description: https://datasheet.ciiva.com/2012/ref3012-2012418.pdf; ComponentLink2URL: https://datasheet.ciiva.com/27052/1493492-27052290.pdf; ComponentLink2Description: https://datasheet.ciiva.com/27052/1493492-27052290.pdf; ComponentLink3URL: https://datasheet.ciiva.com/2012/ref3012-2012419.pdf; ComponentLink3Description: https://datasheet.ciiva.com/2012/ref3012-2012419.pdf; ComponentLink4URL: https://datasheet.ciiva.com/2012/ref3012-2012420.pdf; ComponentLink4Description: https://datasheet.ciiva.com/2012/ref3012-2012420.pdf; ComponentLink5URL: https://datasheet.ciiva.com/15149/getdatasheetpartid-253850-15149190.pdf; ComponentLink5Description: https://datasheet.ciiva.com/15149/getdatasheetpartid-253850-15149190.pdf; ComponentLink6URL: https://datasheet.ciiva.com/3236/sbvs032f-3236285.pdf; ComponentLink6Description: https://datasheet.ciiva.com/3236/sbvs032f-3236285.pdf; Manufacturer Part Number: REF3025AIDBZR